# Altium project node_rp2040.PrjPcb
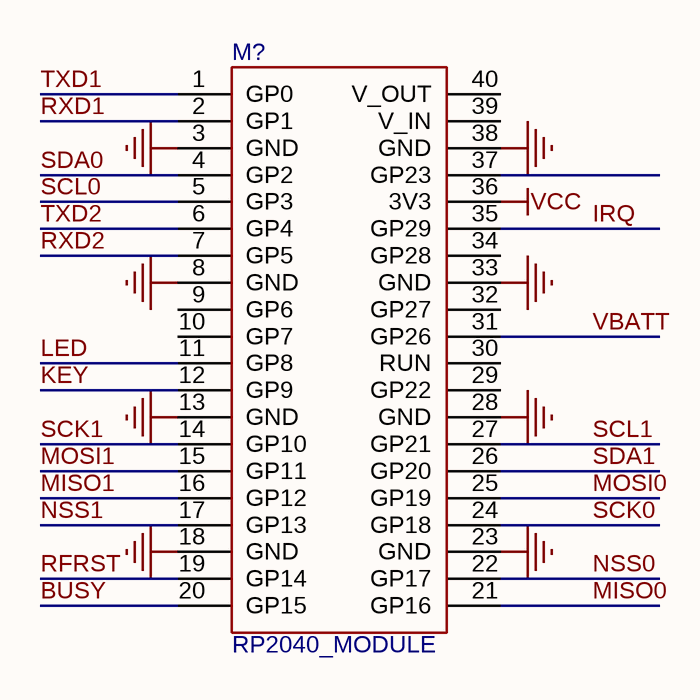
[diagram p0: rp2040_node.SchDoc]
1 sheet, 1 parts. Net scope: global (net labels, ports and power ports of the same name join across sheets).

## Sheet rp2040_node.SchDoc
size 431 x 279 mm; SheetNumber: 1; SheetTotal: 1

### Parts
M?  RP2040_MODULE

### Nets
GND: M?.3(GND) M?.8(GND) M?.13(GND) M?.18(GND) M?.23(GND) M?.28(GND) M?.33(GND) M?.38(GND)
VCC: M?.36(3V3)
BUSY: M?.20(GP15)
IRQ: M?.35(GP29)
KEY: M?.12(GP9)
LED: M?.11(GP8)
MISO0: M?.21(GP16)
MISO1: M?.16(GP12)
MOSI0: M?.25(GP19)
MOSI1: M?.15(GP11)
NSS0: M?.22(GP17)
NSS1: M?.17(GP13)
RFRST: M?.19(GP14)
RXD1: M?.2(GP1)
RXD2: M?.7(GP5)
SCK0: M?.24(GP18)
SCK1: M?.14(GP10)
SCL0: M?.5(GP3)
SCL1: M?.27(GP21)
SDA0: M?.4(GP2)
SDA1: M?.26(GP20)
TXD1: M?.1(GP0)
TXD2: M?.6(GP4)
VBATT: M?.31(GP26)

Not connected (* = marked no-connect by the designer): M? 9(GP6) 10(GP7) 29(GP22) 30(RUN) 32(GP27) 34(GP28) 37(GP23) 39(V_IN) 40(V_OUT)

### Notes on the sheet
- DWG. NO.
- REV.
- SHT.
- THIS DOCUMENT AND THE DATA DISCLOSED HEREIN OR HEREWITH IS THE PROPERTY OF ALTIUM LIMITED AND MAY BE FREELY DISTRIBUTED IN WHOLE. NO RIGHTS ARE RESERVED OR EXPRESS OR IMPLIED WARANTEE GIVEN.
- REVISION
- DESCRIPTION
- DATE
- APPROVED
- ENG:
- APPROVALS
- PROJECT
- DSN:
- CHK:
- REFERENCE DOCUMENTS
- PROJECT REVISION:
- TITLE
- DOCUMENT REVISION:
- DESIGN ITEM:
- BOM:
- FAB DWG:
- PCB DWG:
- ASSY DWG:
- SCALE:
- SIZE
- B
- CAGE CODE
- FILE NAME
- DWG NO.
- SHEET
- OF
- REV

### Library data of the parts
M? = RPI_NANO